# EAGLE design LightSensor1 (EAGLE 9.0.1)
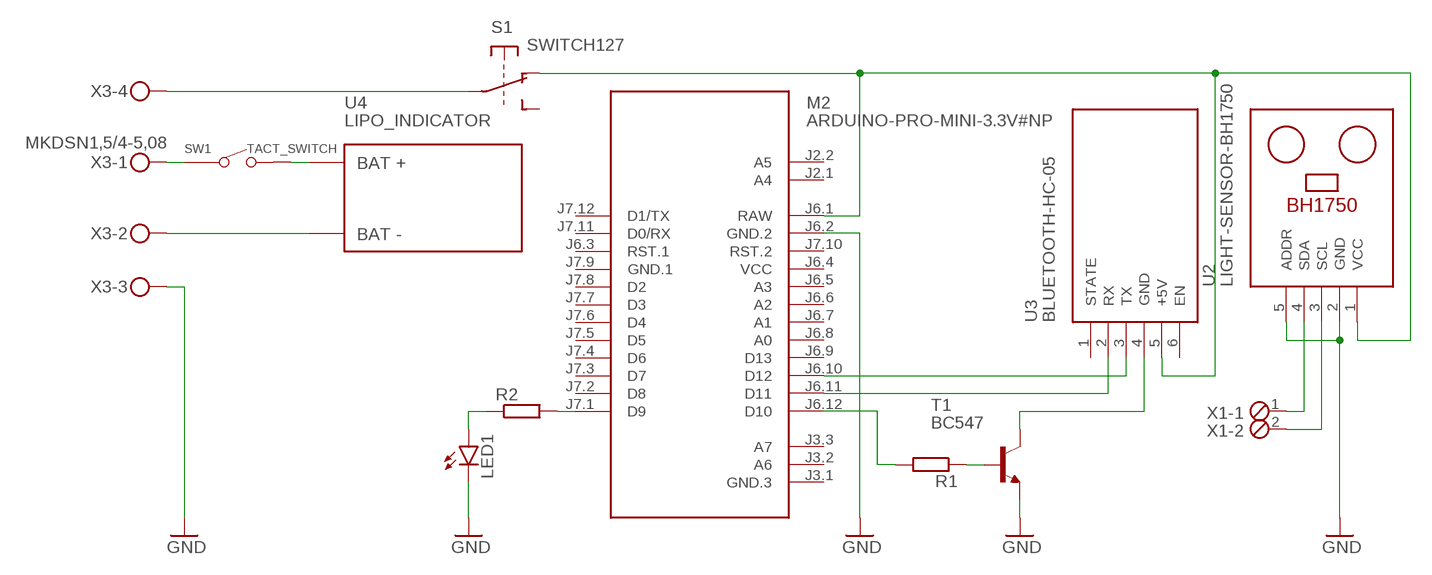
[diagram p0: schematic, sheet 1]

## Parts
LED1  LED3MM  [LED3MM]
M2  ARDUINO-PRO-MINI-3.3V#NP  [ARDUINO-PRO-MINI#NP]
R1  R-EU_0207/10  [0207/10]
R2  R-EU_0207/10  [0207/10]
S1  SWITCH127  [SWITCH127]
SW1  TACT_SWITCH  [SW2-5.0-6.0X3.0X4.3MM]
T1  BC547  [TO92]
U2  LIGHT-SENSOR-BH1750  [LIGHT-SENSOR-BH1750]
U3  BLUETOOTH-HC-05  WIRELESS-BLUETOOTH-HC-05  [WIRELESS-BLUETOOTH-HC-05]
U4  LIPO_INDICATOR  [INDICATROR_NR1]
X1  MPT2  [2POL254]
X3  MKDSN1,5/4-5,08  [MKDSN1,5/4-5,08]

## Nets
GND: LED1.K(C) M2.J6.2(GND.2) T1.1(E) U2.2(GND) U2.5(ADDR) X3.3
N$1: U4.-BAT X3.2
N$2: SW1.2 U4.+BAT
N$3: SW1.1 X3.1
N$4: M2.J6.11(D11) U3.2(RX)
N$5: S1.P$2 X3.4
N$6: LED1.A R2.1
N$7: M2.J6.1(RAW) S1.P$3 U2.1(VCC) U3.5(+5V)
N$8: M2.J7.1(D9) R2.2
N$9: M2.J6.10(D12) U3.3(TX)
N$10: M2.J6.12(D10) R1.2
N$11: R1.1 T1.2(B)
N$12: T1.3(C) U3.4(GND)
N$15: U2.4(SDA) X1.1
N$16: U2.3(SCL) X1.2
Unconnected: M2.J2.1(A4) M2.J2.2(A5) M2.J3.1(GND.3) M2.J3.2(A6) M2.J3.3(A7) M2.J6.3(RST.1) M2.J6.5(A3) M2.J6.6(A2) M2.J6.7(A1) M2.J6.8(A0) M2.J6.9(D13) M2.J7.2(D8) M2.J7.3(D7) M2.J7.4(D6) M2.J7.5(D5) M2.J7.6(D4) M2.J7.7(D3) M2.J7.8(D2) M2.J7.10(RST.2) M2.J7.11(D0/RX) M2.J7.12(D1/TX) S1.P$1 U3.1(STATE) U3.6(EN)

## Power pins joined to a net without a drawn wire
GND.1: M2.J7.9(GND.1)
VCC: M2.J6.4(VCC)

## Library data of the parts
LED1 = led:LED: LED OSRAM: - CHIPLED LG R971, LG N971, LY N971, LG Q971, LY Q971, LO R971, LY R971 LH N974, LH R974 LS Q976, LO Q976, LY Q976 LO Q996 - Hyper CHIPLED LW Q18S LB Q993, LB Q99A, LB R99A - SideLED LS A670, LO A670, LY A670, LG A670, LP A670 LB A673, LV A673, LT A673, LW A673 LH A674 LY A675 LS A676, LA A676, LO A676, LY A676, LW A676 LS A679, LY A679, LG A679 - Hyper Micro SIDELED® LS Y876, LA Y876, LO Y876, LY Y876 LT Y87S - SmartLED LW L88C, LW L88S LB L89C, LB L89S, LG L890 LS L89K, LO L89K, LY L89K LS L896, LA L896, LO L896, LY L896 - TOPLED LS T670, LO T670, LY T670, LG T670, LP T670 LSG T670, LSP T670, LSY T670, LOP T670, LYG T670 LG T671, LOG T671, LSG T671 LB T673, LV T673, LT T673, LW T673 LH T674 LS T676, LA T676, LO T676, LY T676, LB T676, LH T676, LSB T676, LW T676 LB T67C, LV T67C, LT T67C, LS T67K, LO T67K, LY T67K, LW E67C LS E67B, LA E67B, LO E67B, LY E67B, LB E67C, LV E67C, LT E67C LW T67C LS T679, LY T679, LG T679 LS T770, LO T770, LY T770, LG T770, LP T770 LB T773, LV T773, LT T773, LW T773 LH T774 LS E675, LA E675, LY E675, LS T675 LS T776, LA T776, LO T776, LY T776, LB T776 LHGB T686 LT T68C, LB T68C - Hyper Mini TOPLED® LB M676 - Mini TOPLED Santana® LG M470 LS M47K, LO M47K, LY M47K Source: http://www.osram.convergy.de LUXEON: - LUMILED® LXK2-PW12-R00, LXK2-PW12-S00, LXK2-PW14-U00, LXK2-PW14-V00 LXK2-PM12-R00, LXK2-PM12-S00, LXK2-PM14-U00 LXK2-PE12-Q00, LXK2-PE12-R00, LXK2-PE12-S00, LXK2-PE14-T00, LXK2-PE14-U00 LXK2-PB12-K00, LXK2-PB12-L00, LXK2-PB12-M00, LXK2-PB14-N00, LXK2-PB14-P00, LXK2-PB14-Q00 LXK2-PR12-L00, LXK2-PR12-M00, LXK2-PR14-Q00, LXK2-PR14-R00 LXK2-PD12-Q00, LXK2-PD12-R00, LXK2-PD12-S00 LXK2-PH12-R00, LXK2-PH12-S00 LXK2-PL12-P00, LXK2-PL12-Q00, LXK2-PL12-R00 Source: www.luxeon.com KINGBRIGHT: KA-3528ASYC Source: www.kingbright.com
M2 = diy-modules:ARDUINO-PRO-MINI-*#NP: Arduino Pro Mini (and compatible devices) without programming pads More details available here: https://www.arduino.cc/en/Main/ArduinoBoardProMini Click here to find device on ebay.com <http://www.ebay.com/sch/arduino+pro+mini>
R1 R2 = rcl:R-EU_: RESISTOR, European symbol; SPICEPREFIX: R
S1 = lib_2:SWITCH127
SW1 = lib_2:TACT_SWITCH
T1 = transistor:BC547: NPN TRANSISTOR
U2 = diy-modules:LIGHT-SENSOR-BH1750: Digital Light Sensor based on BH1750 BH1750 datasheet is available here: http://www.mouser.com/ds/2/348/bh1750fvi-e-186247.pdf Arduino Library for BH1750 is available here: https://github.com/claws/BH1750 Video Tutorial is available here: https://www.youtube.com/watch?v=UsLcHSbxf_8 Click here to find device on ebay.com <http://www.ebay.com/sch/bh1750fvi+module> Note: There are many variants. Search for the proper version.
U3 = diy-modules:WIRELESS-BLUETOOTH-HC-05: Bluetooth Transceiver Module based on HC-05 board Tutorial is available here: https://arduino-info.wikispaces.com/BlueTooth-HC05-HC06-Modules-How-To Click here to find device on ebay.com <http://www.ebay.com/sch/hc-05+module+rs232>
U4 = lib_2:LIPO_INDICATOR
X1 = con-phoenix-254:MPT2: PHOENIX CONNECTOR; OC_FARNELL: unknown; OC_NEWARK: unknown
X3 = con-phoenix-508:MKDSN1,5/4-5,08: MKDSN 1,5/ 4-5,08 Printklemme Nennstrom: 13,5 A Nennspannung: 250 V Rastermaß: 5,08 mm Polzahl: 4 Anschlussart: Schraubanschluss Montage: Löten Anschlussrichtung Leiter/Platine: 0 ° Artikelnummer: 1729144 Source: http://eshop.phoenixcontact.com .. 1729144.pdf

## Board
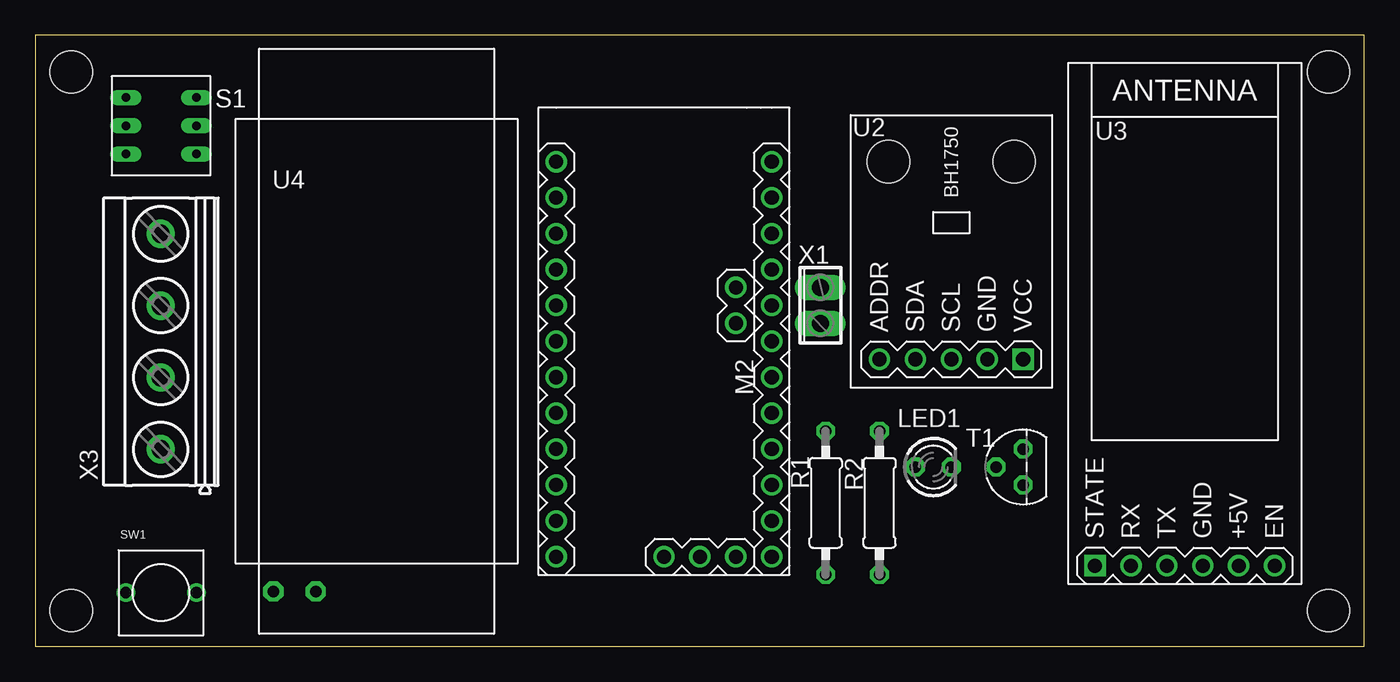
[diagram p1: board, top side]
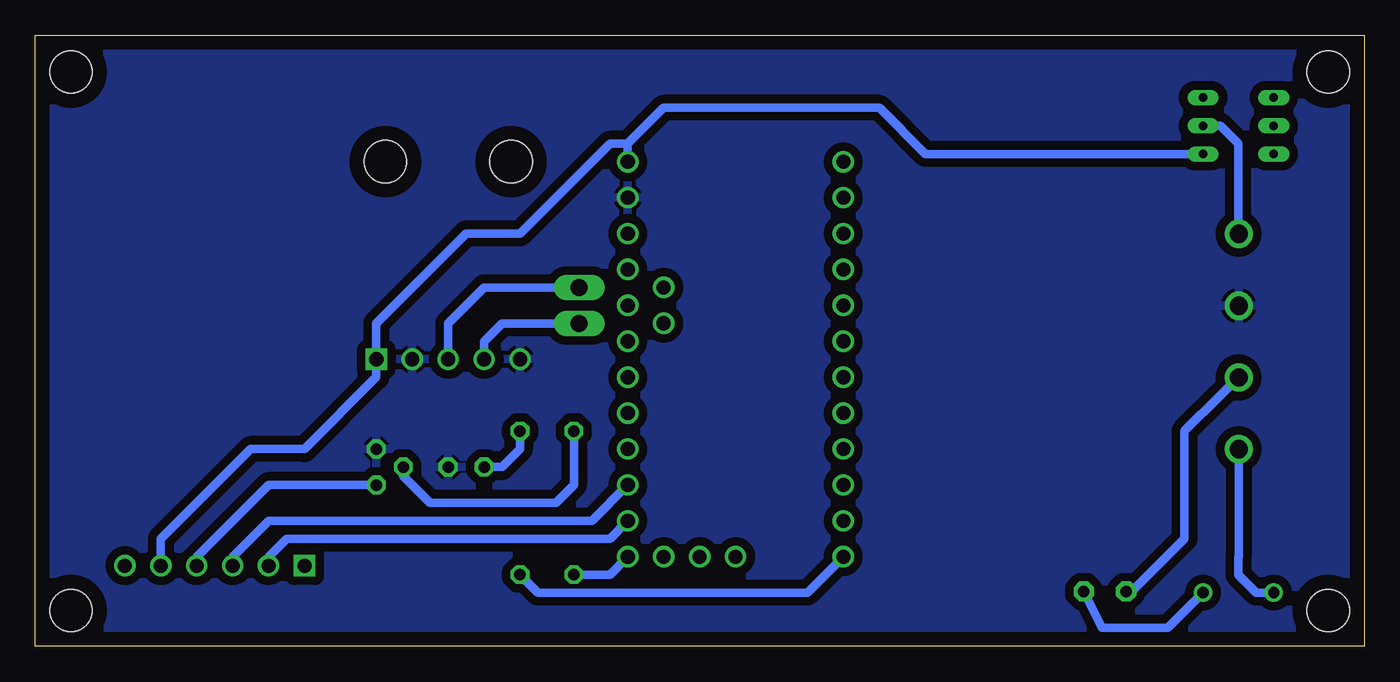
[diagram p2: board, bottom side, seen from below]

Size 93.96 x 43.23 mm. Coordinates in mm from the lower left corner, seen from the top.
Outline: 0,0 93.96,0 93.96,43.23 0,43.23 0,0
Copper layers (1*16): Top 0.035mm / dielectric 1.5mm / Bottom 0.035mm
Design rules "default": minimum track width 6mil, minimum drill 0.35mm, track to track 6mil, track to pad 6mil, pad to pad 6mil, via to via 6mil, smd to smd 6mil, copper to edge 40mil, drill to drill 6mil, minimum pad ring 10mil, minimum via ring 8mil, stop-mask expansion 4mil, vias tented up to drill 0mil, thermal gap 10mil
Holes 3 mm at 2.54,40.64 91.44,40.64 2.54,2.54 91.44,2.54

### Footprints (pad centres in the part's own frame; a part is rotated, then mirrored left to right if it is on the bottom)
LED3MM = drill 0.813 octagon: A -1.27,0; K 1.27,0
ARDUINO-PRO-MINI#NP = drill 1: J2.1 -1.27,5.08; J2.2 -3.81,5.08; J3.1 15.24,0; J3.2 15.24,2.54; J3.3 15.24,5.08; J6.1 -12.7,7.62; J6.2 -10.16,7.62; J6.3 -7.62,7.62; J6.4 -5.08,7.62; J6.5 -2.54,7.62; J6.6 0,7.62; J6.7 2.54,7.62; J6.8 5.08,7.62; J6.9 7.62,7.62; J6.10 10.16,7.62; J6.11 12.7,7.62; J6.12 15.24,7.62; J7.1 15.24,-7.62; J7.2 12.7,-7.62; J7.3 10.16,-7.62; J7.4 7.62,-7.62; J7.5 5.08,-7.62; J7.6 2.54,-7.62; J7.7 0,-7.62; J7.8 -2.54,-7.62; J7.9 -5.08,-7.62; J7.10 -7.62,-7.62; J7.11 -10.16,-7.62; J7.12 -12.7,-7.62
0207/10 = drill 0.813 octagon: 1 -5.08,0; 2 5.08,0
SWITCH127 = drill 0.6 long: P$1 -2,2.5; P$2 0,2.5; P$3 2,2.5; P$4 -2,-2.5; P$5 0,-2.5; P$6 2,-2.5
SW2-5.0-6.0X3.0X4.3MM = drill 0.8 pad 1.27: 1 -2.5,0; 2 2.5,0
TO92 = drill 0.813 octagon: 1 1.27,0; 2 0,1.905; 3 -1.27,0
LIGHT-SENSOR-BH1750 = drill 1 square: 1 -7.62,-5.08 | drill 1: 2 -7.62,-2.54; 3 -7.62,0; 4 -7.62,2.54; 5 -7.62,5.08 | hole 3: 6.35,4.445; 6.35,-4.445
WIRELESS-BLUETOOTH-HC-05 = drill 1 square: 1 -6.35,-17.145 | drill 1: 2 -3.81,-17.145; 3 -1.27,-17.145; 4 1.27,-17.145; 5 3.81,-17.145; 6 6.35,-17.145
INDICATROR_NR1 = drill 0.8 pad 1.422 octagon: +BAT 17.7,-4.3; -BAT 17.7,-7.3
2POL254 = drill 1.2 long: 1 -1.27,0; 2 1.27,0
MKDSN1,5/4-5,08 = drill 1.3 pad 2: 1 -7.641,0.025; 2 -2.561,0.025; 3 2.519,0.025; 4 7.599,0.025

### Placement (x,y rotation side)
LED1  63.5,12.7 0 top
M2  44.45,21.59 270 top
R1  55.88,10.16 270 top
R2  59.69,10.16 270 top
S1  8.89,36.83 270 top
SW1  8.89,3.81 0 top
T1  69.85,12.7 90 top
U2  64.77,27.94 90 top
U3  81.28,22.86 0 top
U4  24.13,21.59 270 top
X1  55.5,24.13 90 top
X3  8.89,21.59 90 top

### Tracks (layer width: path | path; a pad name or v marks a point on that pad's centre or on a via)
GND
  pour Bottom (isolate 0.61): 0,44.45 95.25,44.45 95.25,-1.27 0,-1.27 -1.27,-1.27 -1.27,44.45
N$1
  Bottom 0.61: X3.2 10.18,17.76 12.7,15.24 12.7,7.62 16.43,3.89 U4.-BAT
N$2
  Bottom 0.61: U4.+BAT 18.53,1.32 13.88,1.32 SW1.2
N$3
  Bottom 0.61: X3.1 8.87,6.38 8.89,6.35 8.89,5.08 7.62,3.81 SW1.1
N$4
  Bottom 0.61: M2.J6.11 53.34,7.62 76.2,7.62 77.47,6.35 U3.2
N$5
  Bottom 0.61: X3.4 8.89,29.21 8.89,35.56 10.16,36.83 S1.P$2
N$6
  Bottom 0.61: R2.1 59.69,13.97 60.96,12.7 LED1.A
N$7
  Bottom 0.61: 52.07,35.56 M2.J6.1 | U3.5 85.09,7.62 78.74,13.97 74.93,13.97 69.85,19.05 U2.1 69.85,22.86 63.5,29.21 59.69,29.21 53.34,35.56 52.07,35.56 | 52.07,35.56 49.53,38.1 34.29,38.1 31.02,34.83 S1.P$3
N$8
  Bottom 0.61: M2.J7.1 39.37,3.81 58.42,3.81 R2.2
N$9
  Bottom 0.61: M2.J6.10 54.61,8.89 77.47,8.89 80.01,6.35 U3.3
N$10
  Bottom 0.61: M2.J6.12 53.34,5.08 R1.2
N$11
  Bottom 0.61: R1.1 55.88,11.43 57.15,10.16 66.04,10.16 67.94,12.06 T1.2
N$12
  Bottom 0.61: T1.3 77.47,11.43 82.55,6.35 U3.4
N$15
  Bottom 0.61: X1.1 60.96,22.86 62.23,21.59 U2.4
N$16
  Bottom 0.61: U2.3 64.77,22.86 62.23,25.4 X1.2